# Altium schematic sheet Side.SchDoc
size A4
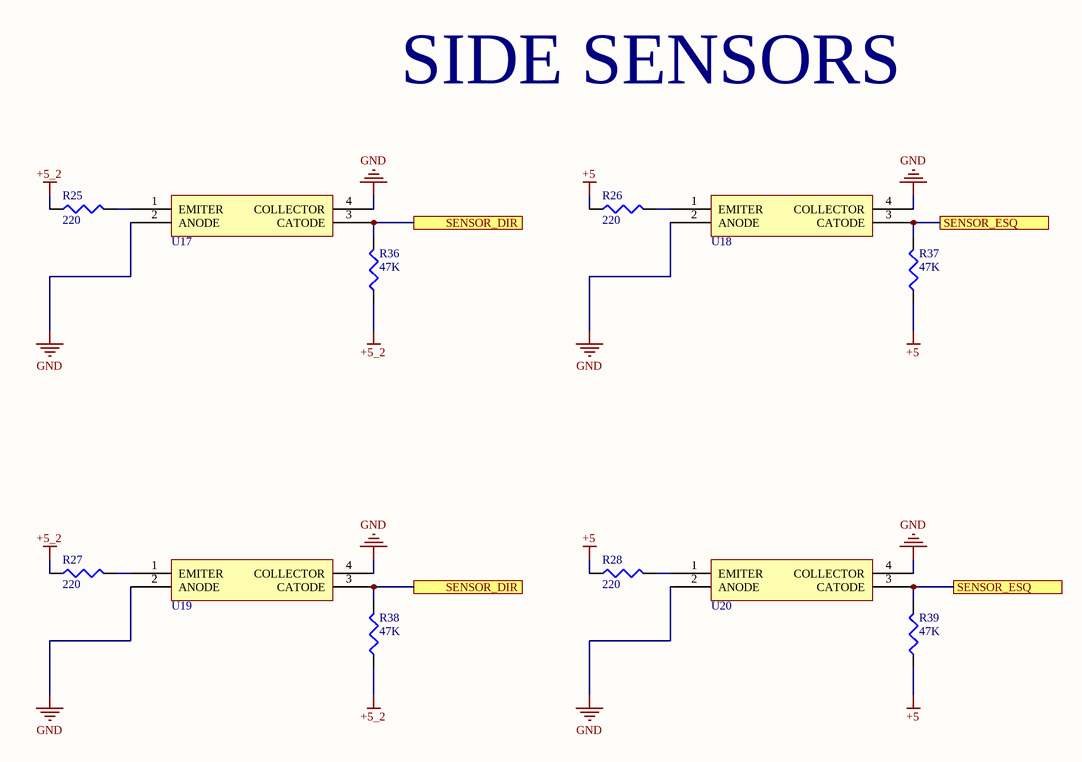
[diagram p0: Side.SchDoc]

## Parts
R25  220  [6-0805_M]
R26  220  [6-0805_M]
R27  220  [6-0805_M]
R28  220  [6-0805_M]
R36  47K  [6-0805_M]
R37  47K  [6-0805_M]
R38  47K  [6-0805_M]
R39  47K  [6-0805_M]
U17  Optical Switches  [QRE1113GR]  (value not drawn)
U18  Optical Switches  [QRE1113GR]  (value not drawn)
U19  Optical Switches  [QRE1113GR]  (value not drawn)
U20  Optical Switches  [QRE1113GR]  (value not drawn)

## Ports
SENSOR_DIR, SENSOR_ESQ

## Nets
+5: R26.1 R28.1 R37.1 R39.1
+5_2: R25.1 R27.1 R36.1 R38.1
GND: U17.2(ANODE) U17.4(COLLECTOR) U18.2(ANODE) U18.4(COLLECTOR) U19.2(ANODE) U19.4(COLLECTOR) U20.2(ANODE) U20.4(COLLECTOR)
SENSOR_DIR: R36.2 R38.2 U17.3(CATODE) U19.3(CATODE) ; port SENSOR_DIR
SENSOR_ESQ: R37.2 R39.2 U18.3(CATODE) U20.3(CATODE) ; port SENSOR_ESQ
NetR25_2: R25.2 U17.1(EMITER)
NetR26_2: R26.2 U18.1(EMITER)
NetR27_2: R27.2 U19.1(EMITER)
NetR28_2: R28.2 U20.1(EMITER)

## Notes on the sheet
- SIDE SENSORS

## Library data of the parts
R25-R28 = Resistor 220 0805: RES SMD 220 OHM 1% 1/8W 0805; Manufacturer: Vishay Semiconductors; Manufacturer Part Number: CRCW0805220RFKEAC; Resistance: 220R; Power Rating: 125mW; Temperature Coefficient: 100ppm/°C; Supplier 1: Mouser; Stock 1: 36802; Pricing 1: 1=0.1, 10=0.052, 100=0.02, 500=0.012, 1000=0.006, 5000=0.005 (USD); Mount: Surface Mount; Case/Package: SMD/SMT; Contact Plating: Tin; Min Operating Temperature: -55°C; Max Operating Temperature: 155°C; Composition: Thick Film; Tolerance: 1%; Termination: Wraparound; Length: 2mm; Lead Free: Lead Free; Supplier Part Number 1: 71-CRCW0805220RFKEAC; Category: Thick Film Resistors - SMD
R36-R39 = Resistor 47K 0805: RES SMD 47K OHM 1% 1/8W 0805; Manufacturer: Vishay; Manufacturer Part Number: CRCW080547K0FKEA; Resistance: 47kR; Voltage Rating: 150V; Power Rating: 125mW; Temperature Coefficient: 100ppm/°C; Supplier 1: Mouser; Stock 1: 21962; Pricing 1: 1=0.1, 10=0.066, 50=0.066, 100=0.047, 1000=0.027, 5000=0.019, 10000=0.015, 25000=0.013, 50000=0.011, 100000=0.01 (USD); Case/Package: 0805; Weight: 0.000194oz; Case Code (Imperial): 0805; Case Code (Metric): 2012; Contact Plating: Tin; Min Operating Temperature: -55°C; Max Operating Temperature: 155°C; Tolerance: 1%; Packaging: Tape and Reel; Package Quantity: 10; Composition: Thick Film; Termination: SMD/SMT; Number of Terminations: 2; Military Standard: Not; Max Power Dissipation: 125mW; Voltage Rating (DC): 150V; Features: Automotive AEC-Q200; Working Voltage: 150V; Length: 2mm; Height: 0.45mm; Width: 1.25mm; Depth: 1.25mm; Radiation Hardening: No; REACH SVHC: Unknown; Lead Free: Lead Free; ComponentLink1URL: https://www.alliedelec.com/m/d/0c934d6939ccefa68dbe0b96d821c8cf.pdf?src-supplier=Allied+Electronics; ComponentLink1Description: https://www.alliedelec.com/m/d/0c934d6939ccefa68dbe0b96d821c8cf.pdf?src-supplier=Allied+Electronics; ComponentLink2URL: http://www.vishay.com/docs/20035/dcrcwe3.pdf?src-supplier=Digi-Key; ComponentLink2Description: http://www.vishay.com/docs/20035/dcrcwe3.pdf?src-supplier=Digi-Key; ComponentLink3URL: http://www.vishay.com/docs/20035/dcrcwe3.pdf?src-supplier=Future+Electronics; ComponentLink3Description: http://www.vishay.com/docs/20035/dcrcwe3.pdf?src-supplier=Future+Electronics; ComponentLink4URL: https://www.distrelec.biz/Web/Downloads/a_/en/flD-CRCW-e3_data_en.pdf?mime=application%2Fpdf&src-supplier=Distrelec; ComponentLink4Description: https://www.distrelec.biz/Web/Downloads/a_/en/flD-CRCW-e3_data_en.pdf?mime=application%2Fpdf&src-supplier=Distrelec; ComponentLink5URL: http://www.farnell.com/datasheets/2310790.pdf?src-supplier=Element14; ComponentLink5Description: http://www.farnell.com/datasheets/2310790.pdf?src-supplier=Element14; ComponentLink6URL: http://www.vishay.com/docs/20035/dcrcwe3.pdf?src-supplier=Avnet; ComponentLink6Description: http://www.vishay.com/docs/20035/dcrcwe3.pdf?src-supplier=Avnet; ComponentLink7URL: http://uk.rs-online.com/webdocs/0d98/0900766b80d98b26.pdf?src-supplier=RSComponents; ComponentLink7Description: http://uk.rs-online.com/webdocs/0d98/0900766b80d98b26.pdf?src-supplier=RSComponents; ComponentLink8URL: http://www.vishay.com/docs/20035/dcrcwe3.pdf?src-supplier=Avnet+Europe; ComponentLink8Description: http://www.vishay.com/docs/20035/dcrcwe3.pdf?src-supplier=Avnet+Europe; ComponentLink9URL: http://www.farnell.com/datasheets/2046716.pdf?src-supplier=Element14; ComponentLink9Description: http://www.farnell.com/datasheets/2046716.pdf?src-supplier=Element14; Supplier Part Number 1: 71-CRCW0805-47K-E3; Category: Thick Film Resistors - SMD
U17-U20 = Optical Switches: SENSOR OPTO TRANS REFL SMD PHOTO; Manufacturer: ON Semiconductor / Fairchild; Wavelength: 940nm; Forward Current: 50mA; Rise Time: 20us; Forward Voltage: 1.2V; Sensing Distance: 0.197inch; Collector Emitter Voltage (VCEO): 30V; Max Collector Current: 20mA; Number of Channels: 1; Reverse Breakdown Voltage: 5V; Power Dissipation: 75mW; Operating Supply Voltage: 1.7V; Output Type: Phototransistor; Supplier 1: Mouser; Manufacturer Part Number: QRE1113GR; Stock 1: 10425; Pricing 1: 1=0.86, 10=0.713, 50=0.713, 100=0.46, 1000=0.368, 10000=0.3 (USD); Mount: Surface Mount; Case/Package: SMD/SMT; Number of Pins: 4; Weight: 0.078g; Contact Plating: Tin,Matte; Min Operating Temperature: -40°C; Max Operating Temperature: 85°C; Packaging: Tape and Reel; Fall Time: 20us; Package Quantity: 1000; Reverse Voltage (DC): 5V; Collector Emitter Breakdown Voltage: 30V; Response Time: 20us; Max Breakdown Voltage: 30V; Number of Elements: 1; Input Current: 50mA; Max Power Dissipation: 75mW; Length: 3.6mm; Height: 1.7mm; Width: 2.9mm; Radiation Hardening: No; REACH SVHC: No SVHC; Lead Free: Lead Free; ComponentLink1URL: http://www.farnell.com/datasheets/1725706.pdf?src-supplier=Element14; ComponentLink1Description: http://www.farnell.com/datasheets/1725706.pdf?src-supplier=Element14; ComponentLink2URL: https://www.verical.com/server-webapp/html/getDatasheet?partID=146181&src-supplier=Verical; ComponentLink2Description: https://www.verical.com/server-webapp/html/getDatasheet?partID=146181&src-supplier=Verical; ComponentLink3URL: https://www.fairchildsemi.com/datasheets/QR/QRE1113.pdf?src-supplier=Avnet; ComponentLink3Description: https://www.fairchildsemi.com/datasheets/QR/QRE1113.pdf?src-supplier=Avnet; ComponentLink4URL: http://www.fairchildsemi.com/ds/QR/QRE1113.pdf?src-supplier=Avnet+Europe; ComponentLink4Description: http://www.fairchildsemi.com/ds/QR/QRE1113.pdf?src-supplier=Avnet+Europe; ComponentLink5URL: https://www.fairchildsemi.com/datasheets/QR/QRE1113.pdf?src-supplier=Digi-Key; ComponentLink5Description: https://www.fairchildsemi.com/datasheets/QR/QRE1113.pdf?src-supplier=Digi-Key; Supplier Part Number 1: 512-QRE1113GR; Category: Optical Switches, Reflective, Phototransistor Output